# Altium schematic sheet Electrovalvulas.SchDoc
size A4
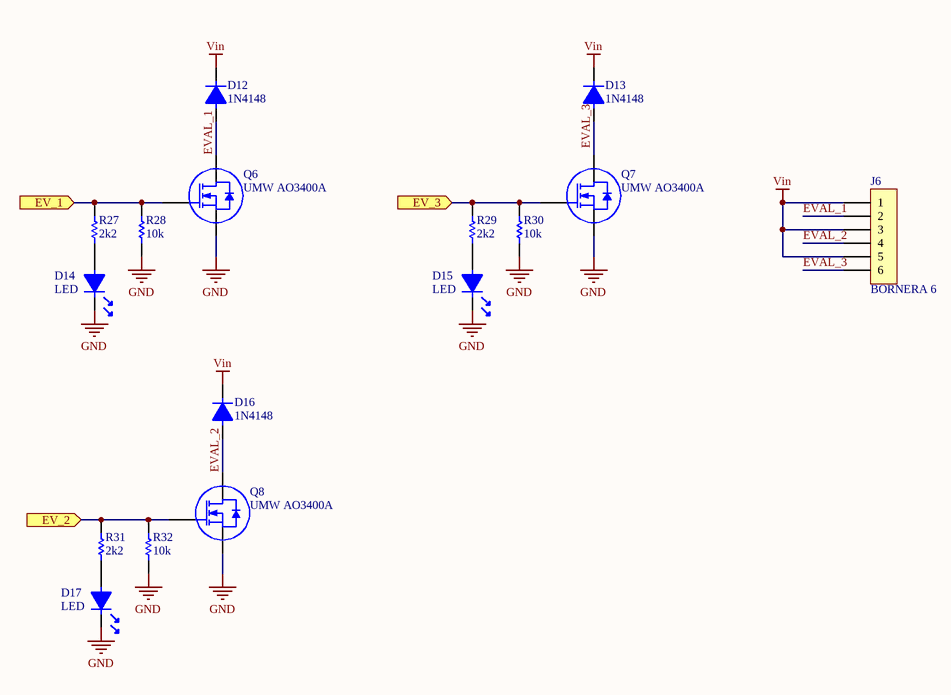
[diagram p0: Electrovalvulas.SchDoc]

## Parts
D12  1N4148  [1206K]
D13  1N4148  [1206K]
D14  LED  [LED0805]
D15  LED  [LED0805]
D16  1N4148  [1206K]
D17  LED  [LED0805]
J6  BORNERA 6  [BORNERA6]
Q6  UMW AO3400A  [SOT23]
Q7  UMW AO3400A  [SOT23]
Q8  UMW AO3400A  [SOT23]
R27  2k2  [0805]
R28  10k  [0805]
R29  2k2  [0805]
R30  10k  [0805]
R31  2k2  [0805]
R32  10k  [0805]

## Ports
EV_1 (in), EV_2 (in), EV_3 (in)

## Nets
GND: D14.2 D15.2 D17.2 Q6.3(S) Q7.3(S) Q8.3(S) R28.1 R30.1 R32.1
Vin: D12.2 D13.2 D16.2 J6.1 J6.3 J6.5
EV_1: Q6.1(G) R27.2 R28.2 ; port EV_1
EV_2: Q8.1(G) R31.2 R32.2 ; port EV_2
EV_3: Q7.1(G) R29.2 R30.2 ; port EV_3
EVAL_1: D12.1 J6.2 Q6.2(D)
EVAL_2: D16.1 J6.4 Q8.2(D)
EVAL_3: D13.1 J6.6 Q7.2(D)
NetD14_1: D14.1 R27.1
NetD15_1: D15.1 R29.1
NetD17_1: D17.1 R31.1

## Library data of the parts
D12 D13 D16 = DIODO
Q6-Q8 = MOSFET N
R27-R32 = RES